# Altium project Rasberry Pi.PrjPcb
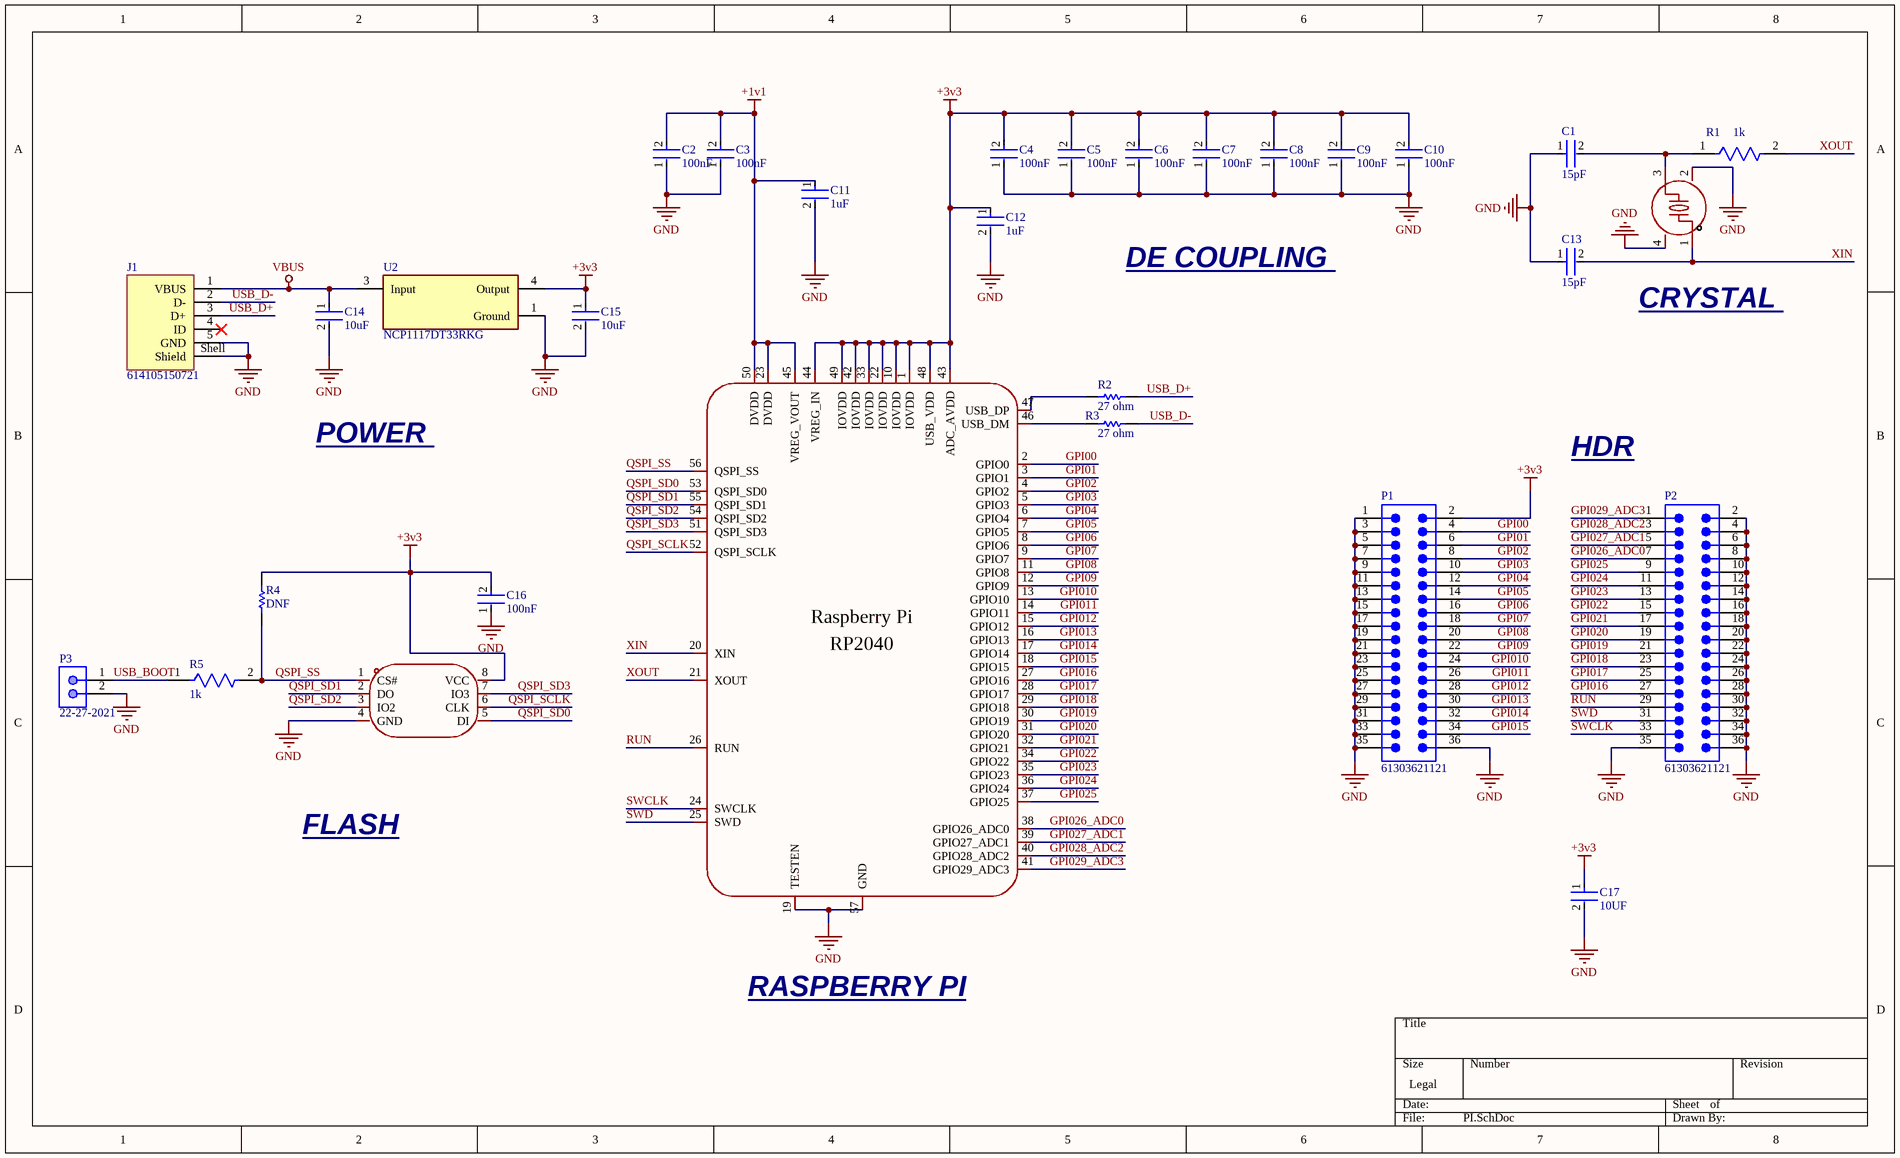
[diagram p0: PI.SchDoc]
1 sheet, 30 parts. Net scope: global (net labels, ports and power ports of the same name join across sheets).
Board file: PI.PcbDoc

## Sheet PI.SchDoc
size Legal; SheetNumber: 1; SheetTotal: 1

### Parts
C1  15pF  [FP-C0402-BB-MFG]
C2  100nF  [FP-GRM15-MFG]
C3  100nF  [FP-GRM15-MFG]
C4  100nF  [FP-GRM15-MFG]
C5  100nF  [FP-GRM15-MFG]
C6  100nF  [FP-GRM15-MFG]
C7  100nF  [FP-GRM15-MFG]
C8  100nF  [FP-GRM15-MFG]
C9  100nF  [FP-GRM15-MFG]
C10  100nF  [FP-GRM15-MFG]
C11  1uF  [FP-C0805C105Z4VACTU-MFG]
C12  1uF  [FP-C0805C105Z4VACTU-MFG]
C13  15pF  [FP-C0402-BB-MFG]
C14  10uF  [FP-1206-L_3_2_0_2-W_1_6_0-IPC_C]
C15  10uF  [FP-1206-L_3_2_0_2-W_1_6_0-IPC_C]
C16  100nF  [FP-GRM15-MFG]
C17  10UF  [FP-0603-L_1_6_0_2-W_0_8_0-MFG]
J1  614105150721  [614105150721]
P1  61303621121  [61303621121]
P2  61303621121  [61303621121]
P3  22-27-2021  [MOLX-22-27-2021_V]
R1  1k  [FP-AC0603-IPC_B]
R2  27 ohm  [RESC1005X40X25LL05T10]
R3  27 ohm  [RESC1005X40X25LL05T10]
R4  DNF  [RESC2013X50X30LL20T20]
R5  1k  [FP-AC0603-IPC_B]
U1  ABM8-272-T3  [CRYSTAL-SMD_4P-L3.2-W2.5-BL]  (value not drawn)
U2  NCP1117DT33RKG  [FP-369C-MFG]
U3  RP2040  [LQFN-56_L7.0-W7.0-P0.4-EP]  (value not drawn)
U4  W25Q128JVSIQ  [SOIC-8_L5.3-W5.3-P1.27-LS8.0-BL]  (value not drawn)

### Nets
+1v1: C2.2 C3.2 C11.1 U3.23(DVDD) U3.45(VREG_VOUT) U3.50(DVDD)
+3v3: C4.2 C5.2 C6.2 C7.2 C8.2 C9.2 C10.2 C12.1 C15.1 C16.2 C17.1 P1.2 R4.2 U2.4(Output) U3.1(IOVDD) U3.10(IOVDD) U3.22(IOVDD) U3.33(IOVDD) U3.42(IOVDD) U3.43(ADC_AVDD) U3.44(VREG_IN) U3.48(USB_VDD) U3.49(IOVDD) U4.8(VCC)
GND: C1.1 C2.1 C3.1 C4.1 C5.1 C6.1 C7.1 C8.1 C9.1 C10.1 C11.2 C12.2 C13.1 C14.2 C15.2 C16.1 C17.2 J1.5(GND) J1.Shell(Shield) P1.1 P1.3 P1.5 P1.7 P1.9 P1.11 P1.13 P1.15 P1.17 P1.19 P1.21 P1.23 P1.25 P1.27 P1.29 P1.31 P1.33 P1.35 P1.36 P2.2 P2.4 P2.6 P2.8 P2.10 P2.12 P2.14 P2.16 P2.18 P2.20 P2.22 P2.24 P2.26 P2.28 P2.30 P2.32 P2.34 P2.35 P2.36 P3.2 U1.2(GND) U1.4(GND) U2.1(Ground) U3.19(TESTEN) U3.57(GND) U4.4(GND)
VBUS: C14.1 J1.1(VBUS) U2.3(Input)
GPI00: P1.4 U3.2(GPIO0)
GPI01: P1.6 U3.3(GPIO1)
GPI02: P1.8 U3.4(GPIO2)
GPI03: P1.10 U3.5(GPIO3)
GPI04: P1.12 U3.6(GPIO4)
GPI05: P1.14 U3.7(GPIO5)
GPI06: P1.16 U3.8(GPIO6)
GPI07: P1.18 U3.9(GPIO7)
GPI08: P1.20 U3.11(GPIO8)
GPI09: P1.22 U3.12(GPIO9)
GPI010: P1.24 U3.13(GPIO10)
GPI011: P1.26 U3.14(GPIO11)
GPI012: P1.28 U3.15(GPIO12)
GPI013: P1.30 U3.16(GPIO13)
GPI014: P1.32 U3.17(GPIO14)
GPI015: P1.34 U3.18(GPIO15)
GPI016: P2.27 U3.27(GPIO16)
GPI017: P2.25 U3.28(GPIO17)
GPI018: P2.23 U3.29(GPIO18)
GPI019: P2.21 U3.30(GPIO19)
GPI020: P2.19 U3.31(GPIO20)
GPI021: P2.17 U3.32(GPIO21)
GPI022: P2.15 U3.34(GPIO22)
GPI023: P2.13 U3.35(GPIO23)
GPI024: P2.11 U3.36(GPIO24)
GPI025: P2.9 U3.37(GPIO25)
GPI026_ADC0: P2.7 U3.38(GPIO26_ADC0)
GPI027_ADC1: P2.5 U3.39(GPIO27_ADC1)
GPI028_ADC2: P2.3 U3.40(GPIO28_ADC2)
GPI029_ADC3: P2.1 U3.41(GPIO29_ADC3)
QSPI_SCLK: U3.52(QSPI_SCLK) U4.6(CLK)
QSPI_SD0: U3.53(QSPI_SD0) U4.5(DI)
QSPI_SD1: U3.55(QSPI_SD1) U4.2(DO)
QSPI_SD2: U3.54(QSPI_SD2) U4.3(IO2)
QSPI_SD3: U3.51(QSPI_SD3) U4.7(IO3)
QSPI_SS: R4.1 R5.2 U3.56(QSPI_SS) U4.1(CS#)
RUN: P2.29 U3.26(RUN)
SWCLK: P2.33 U3.24(SWCLK)
SWD: P2.31 U3.25(SWD)
USB_BOOT: P3.1 R5.1
USB_D+: J1.3(D+) R2.2
USB_D-: J1.2(D-) R3.2
XIN: C13.2 U1.1 U3.20(XIN)
XOUT: R1.2 U3.21(XOUT)
NetC1_2: C1.2 R1.1 U1.3
NetR2_1: R2.1 U3.47(USB_DP)
NetR3_1: R3.1 U3.46(USB_DM)

Not connected (* = marked no-connect by the designer): J1 4(ID)*

### Notes on the sheet
- DE COUPLING
- CRYSTAL
- POWER
- HDR
- FLASH
- RASPBERRY PI
- (in symbol RP2040_C2040) Raspberry Pi

### Library data of the parts
C1 C13 = CMP-1034-00802-4: CAP CER 15PF 16V 5% NP0 0402; Manufacturer: Kemet; Manufacturer Part Number: C0402C150J4GACTU; Material: Ceramic; Tolerance: 0.05; Description: C0402 15 pF C0G 5.00% 16 V; Temperature Coefficient: 15%; Temperature Characteristic: C0G; Automotive: No; Temperature Range High: +125°C; RoHS: TRUE; Capacitance: 15 pF; Temperature Range Low: -55°C; Height: 0.55mm; Octopart: https://octopart.com/c0402c150j4gactu-kemet-9140080; Mouser Description: Multilayer Ceramic Capacitors MLCC - SMD/SMT 16volts 15pF C0G 5%; Ipc Land Pattern Name: CAPC10050X50; ComponentLink2URL: https://content.kemet.com/datasheets/KEM_C1002_X7R_SMD.pdf; Lead Free: Yes; Category: Cap; Device Class L2: Capacitors; ComponentLink2Description: Datasheet; Temperature: -55°C to +125°C; Device Class L1: Passive Components; Digikey Description: CAP CER 15PF 16V 5% NP0 0402; Device Class L3: Ceramic Capacitors; Voltage Rating: 16 V; Package: C0402-BB; Value: 15 pF
C2-C10 C16 = CMP-2100-03641-2: CAP CER 0.1UF 16V X7R 0402; Manufacturer Part Number: GRM155R71C104KA88D; Manufacturer: Murata; Standoff Height: 0mm; Tolerance: 10%; Description: CAP Ceramic 0.10μF 10% X7R 16Vdc 0402 SMD; Voltage Rating: 16Vdc; Material: Ceramic; Capacitance: 0.10μF; Value: 0.10μF; RoHS: TRUE; Temperature Characteristic: X7R; Octopart: https://octopart.com/grm155r71c104ka88d-murata-196880; Digikey Description: CAP CER 0.1UF 16V X7R 0402; Device Class L3: Ceramic Capacitors; Height: 0.55mm; ComponentLink2Description: Datasheet; Temperature Range Low: -55°C; Ipc Land Pattern Name: CAPC10050X219; ComponentLink2URL: https://search.murata.co.jp/Ceramy/image/img/A01X/G101/ENG/GRM155R71H471KA01-01A.pdf; Device Class L1: Passive Components; Lead Free: yes; Category: Cap; Package: GRM15; Temperature: -55°C to +125°C; Device Class L2: Capacitors; Temperature Range High: +125°C; Mouser Description: 0402 0.1 uF 16V ±10 % Tolerance X7R SMT Multilayer Ceramic Capacitor
C11 C12 = CMP-2007-03241-2: CAP CER 1UF 16V Y5V 0805; Tolerance: 80%; Dielectric Material: Ceramic; Dissipation Factor: 7%; Depth: 1.25mm; Voltage: 16V; Dielectric: Y5V; Max Operating Temperature: 85°C; REACH SVHC: No SVHC; Thickness: 0.055inch; Capacitance: 1uF; Case Code (Imperial): 0805; Case/Package: 0805; Height: 1.25mm; Contact Material: Tin; Radiation Hardening: No; Min Operating Temperature: -30°C; Length: 2mm; Lead Free: Lead Free; Case Code (Metric): 2012; Packaging: Tape and Reel; Number of Pins: 2; Series: C; RoHS Compliant: Yes; Termination: SMD/SMT; Mount: Surface Mount; Lead Pitch: 0.75mm; Voltage Rating: 16V; Package Quantity: 1; Voltage Rating (DC): 16V; Construction: Flat; Width: 0.049inch
C14 C15 = CMP-1661-00005-2: General Purpose Ceramic Capacitor, 1206, 10uF, 10%, X7R, 15%, 16V; Dissipation Factor: 3.5%; Height: 1.78mm; Mount: Surface Mount; Package Quantity: 2500; Radiation Hardening: No; Capacitance: 10uF; Width: 0.063inch; Packaging: Tape and Reel; Voltage: 16V; REACH SVHC: No SVHC; Construction: Flat; Case Code (Metric): 3216; Lead Free: Lead Free; Thickness: 0.07inch; Voltage Rating: 16V; Termination: SMD/SMT; Length: 3.2mm; Tolerance: 10%; Series: -; Max Operating Temperature: 125°C; Case/Package: 1206; Number of Pins: 2; RoHS Compliant: Yes; Voltage Rating (DC): 16V; Depth: 1.6mm; Dielectric: X7R; Case Code (Imperial): 1206; Min Operating Temperature: -55°C
C17 = CMP-2000-06226-4: Multilayer Ceramic Capacitor 10uF 16V X5R 20% SMD 0603 T/R; Packaging: Tape and Reel; Construction: Flat; Height: 0.8mm; Max Operating Temperature: 85°C; Dielectric: X5R; Case Code (Metric): 1608; Voltage Rating (DC): 16V; Width: 0.031inch; Voltage Rating: 16V; Length: 0.063inch; RoHS Compliant: Yes; Halogen Free: Halogen Free; Case Code (Imperial): 0603; Capacitance: 10uF; Mount: Surface Mount; Thickness: 0.031inch; Tolerance: 20%; Min Operating Temperature: -55°C; Series: M; Termination: SMD/SMT; Case/Package: 0603; Package Quantity: 1
J1 = CMP-1502-03250-2: NexarPartId: 52645111; USB Standard: USB 2.0; Current Rating: 1.8A; Connector Type: USB; Operating Supply Voltage: 30V; Gender: Receptacle; Number of Contacts: 5; Contact Resistance: 30mΩ; Insulation Resistance: 1GΩ; Height: 5.81mm; RoHS: Compliant; Packaging: Tape and Reel; Number of Pins: 5; Orientation: Vertical; Max Operating Temperature: 85°C; Min Operating Temperature: -40°C; Contact Plating: Gold; Contact Material: Gold; Voltage Rating: 30V; Mount: Through Hole, Vertical; REACH SVHC: Unknown; Features: Shielded; Lead Free: Lead Free
P1 P2 = CMP-1502-01131-3: NexarPartId: 32855576; Operating Supply Voltage: 250V; Connector Type: Male Pin; Gender: Male; Pitch: 2.54mm; Contact Resistance: 20mΩ; Current Rating: 3A; Number of Contacts: 36; Contact Material: Copper; Orientation: Vertical; Contact Mating Length: 5.9944mm; Mount: Through Hole; REACH SVHC: Unknown; RoHS: Compliant; Packaging: Bulk; Number of Rows: 2; Number of Positions: 36; Color: Black; Lead Pitch: 2.54mm; Row Spacing: 2.54mm; Number of Pins: 36; Contact Plating: Gold; Termination: Solder
P3 = CMP-2000-05537-1: Male Header, Pitch 2.54 mm, 1 x 2 Position, Height 11.7 mm, Tail Length 3.56 mm, 0 to 75 degC, RoHS, Bulk; Manufacturer: Molex; PartNumber: 0022272021; Current rating: 4A; Package Version: Rev. BC, 02/2012; Voltage rating: 250V; No. of Positions: 2; Pitch: 2.54mm; No. of Rows: 1; Orientation: Vertical; Operating temperature: 0°Cto+75°C; Manufacturer URL: http://www.molex.com/; Mounting Technology: ThroughHole; Housing material: Nylon(UL94V-0); Package Description: 2-Leads Header, Body 5.08 x 5.8 mm, Pitch 2.54 mm; Voltage - Max: 250V; Datasheet URL: http://www.molex.com/pdm_docs/sd/022272021_sd.pdf; Package Reference: 22-27-2021; Contact material: Tinplatedbrass; Current - Max: 4A; Datasheet Version: Rev. F, 06/2009
R1 R5 = CMP-2000-04828-3: RES 1kΩ 1.00% 0.1W 0603; Voltage Rating: 50V; Power Rating: 100mW; Tolerance: 1%; Temperature Coefficient: 100ppm/°C; Resistance: 1kR; Depth: 0.8mm; Case/Package: 0603; Size Code: 0603; Case Code (Metric): 1608; Height: 0.022inch; Series: AC; Width: 0.031inch; Construction: Rectangular; Length: 0.063inch; Case Code (Imperial): 0603; Package Quantity: 1; RoHS Compliant: Yes; Features: Moisture Resistant; Resistor Type: Thick Film; Max Power Dissipation: 100mW; Packaging: Tape and Reel; Termination: SMD/SMT; Ratings: AEC-Q200; Max Operating Temperature: 155°C; Min Operating Temperature: -55°C; Military Standard: Not; Lead Free: Lead Free; Number of Terminations: 2
R2 R3 = CMP-2002-07055-1: Part Number: RC0402FR-0727RL; Manufacturer: Yageo / Phycomp
R4 = CMP-2001-04896-1: Manufacturer: Vishay Dale; Part Number: CRCW08050000Z0EA
U1 = ABM8-272-T3_C20625731: Manufacturer: ABRACON; Add into BOM: yes; Symbol: ABM8-272-T3_C20625731; Device: ABM8-272-T3_C20625731; LCSC Part Name: ABM8-272-T3; Supplier Part: C20625731; Manufacturer Part: ABM8-272-T3; Supplier Footprint: SMD3225-4P; JLCPCB Part Class: Extended Part; Datasheet: https://atta.szlcsc.com/upload/public/pdf/source/20240227/A8BE43F636D80F75C9AF5C59EDF21E9A.pdf; Supplier: LCSC; Convert to PCB: yes
U2 = CMP-07128-000036-1: IC REG LINEAR 3.3V 1A DPAK-3; Accuracy: 1%; Input Bias Current: 6mA; Min Input Voltage: 10V; Reference Voltage: 1.27V; Dropout Voltage: 1.07V; Number of Regulators: 1; Output Type: Fixed; Quiescent Current: 10mA; Max Input Voltage: 20V; Polarity: Positive; Packaging: Tape and Reel; Number of Pins: 3; Min Current Limit: 1A; Max Output Current: 1A; REACH SVHC: No SVHC; Nominal Output Voltage: 3.3V; Case/Package: DPAK; Min Output Voltage: 3.3V; Length: 6.73mm; Output Voltage Accuracy: 1%; Radiation Hardening: No; Min Operating Temperature: 0°C; Halogen Free: Halogen Free; Width: 6.22mm; Output Voltage: 3.3V; Height: 2.38mm; Lead Free: Lead Free; Output Current: 1A; Package Quantity: 1; Contact Plating: Tin; Number of Outputs: 1; Max Operating Temperature: 125°C; Mount: Surface Mount; Current Rating: 1A
U3 = RP2040_C2040: Manufacturer: Raspberry Pi(树莓派); Add into BOM: yes; CPU Maximum Speed: 133MHz; Number of I/O: 30; ADC (Bit): 12bit; Symbol: RP2040; Device: RP2040_C2040; LCSC Part Name: RP2040（RP2B2）; Supplier Part: C2040; Manufacturer Part: RP2040; Supplier Footprint: LQFN-56(7x7); JLCPCB Part Class: Extended Part; Datasheet: https://atta.szlcsc.com/upload/public/pdf/source/20210621/C2040_96F425825606B7957D87DD32E2512CA9.pdf; Supplier: LCSC; Convert to PCB: yes; CPU Core: -; Applications: -
U4 = W25Q128JVSIQ: Manufacturer: WINBOND(华邦); Symbol: W25Q128JVSIQTR; Add into BOM: yes; Interface Type: SPI; Memory Size: 128Mbit; Clock Frequency (fc): 133MHz; Supply Voltage: 2.7V~3.6V; Page Programming Time (Tpp): 700us; Block Erase Time (tBE): 120ms@(32KB); Data Retention - TDR (Year): 20 years; Device: W25Q128JVSIQ; LCSC Part Name: W25Q128JVSIQ 编带; Supplier Part: C97521; Manufacturer Part: W25Q128JVSIQ; Supplier Footprint: SOIC-8-208mil; JLCPCB Part Class: Basic Part; Datasheet: https://atta.szlcsc.com/upload/public/pdf/source/20170316/1489627409956.pdf; Supplier: LCSC; Convert to PCB: yes; Operating Temperature: -40℃~+85℃